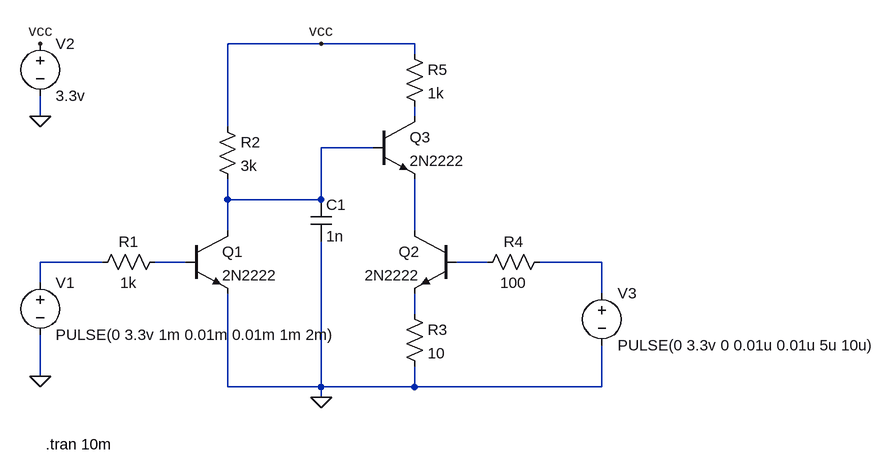
[diagram p0: schematic ook_transmitter.asc]
ook_transmitter.asc, the LTspice schematic file:
Version 4
SHEET 1 1280 680
WIRE 400 -240 256 -240
WIRE 544 -240 400 -240
WIRE 544 -224 544 -240
WIRE -32 -128 -32 -160
WIRE 544 -128 544 -144
WIRE 256 -112 256 -240
WIRE 480 -80 400 -80
WIRE 256 0 256 -32
WIRE 400 0 400 -80
WIRE 400 0 256 0
WIRE 256 48 256 0
WIRE 544 48 544 -32
WIRE 64 96 -32 96
WIRE 192 96 144 96
WIRE 656 96 608 96
WIRE 832 96 736 96
WIRE -32 128 -32 96
WIRE 832 144 832 96
WIRE 544 176 544 144
WIRE -32 272 -32 208
WIRE 256 288 256 144
WIRE 400 288 400 64
WIRE 400 288 256 288
WIRE 544 288 544 256
WIRE 544 288 400 288
WIRE 832 288 832 224
WIRE 832 288 544 288
WIRE 400 304 400 288
FLAG 400 304 0
FLAG -32 272 0
FLAG -32 -128 0
FLAG -32 -240 vcc
FLAG 400 -240 vcc
SYMBOL voltage -32 112 R0
WINDOW 123 0 0 Left 0
WINDOW 39 0 0 Left 0
SYMATTR InstName V1
SYMATTR Value PULSE(0 3.3v 1m 0.01m 0.01m 1m 2m)
SYMBOL res 160 80 R90
WINDOW 0 0 56 VBottom 2
WINDOW 3 32 56 VTop 2
SYMATTR InstName R1
SYMATTR Value 1k
SYMBOL npn 192 48 R0
SYMATTR InstName Q1
SYMATTR Value 2N2222
SYMBOL npn 608 48 M0
SYMATTR InstName Q2
SYMATTR Value 2N2222
SYMBOL npn 480 -128 R0
SYMATTR InstName Q3
SYMATTR Value 2N2222
SYMBOL res 240 -128 R0
SYMATTR InstName R2
SYMATTR Value 3k
SYMBOL res 528 160 R0
SYMATTR InstName R3
SYMATTR Value 10
SYMBOL cap 384 0 R0
SYMATTR InstName C1
SYMATTR Value 1n
SYMBOL res 752 80 R90
WINDOW 0 0 56 VBottom 2
WINDOW 3 32 56 VTop 2
SYMATTR InstName R4
SYMATTR Value 100
SYMBOL voltage -32 -256 R0
WINDOW 123 0 0 Left 0
WINDOW 39 0 0 Left 0
SYMATTR InstName V2
SYMATTR Value 3.3v
SYMBOL voltage 832 128 R0
WINDOW 123 0 0 Left 0
WINDOW 39 0 0 Left 0
SYMATTR InstName V3
SYMATTR Value PULSE(0 3.3v 0 0.01u 0.01u 5u 10u)
SYMBOL res 528 -240 R0
SYMATTR InstName R5
SYMATTR Value 1k
TEXT -24 376 Left 2 !.tran 10m

The netlist it stands for:
* ook_transmitter.asc
V1 N004 0 PULSE(0 3.3v 1m 0.01m 0.01m 1m 2m)
R1 N005 N004 1k
Q1 N002 N005 0 0 2N2222
Q2 N003 N006 N008 0 2N2222
Q3 N001 N002 N003 0 2N2222
R2 vcc N002 3k
R3 N008 0 10
C1 N002 0 1n
R4 N007 N006 100
V2 vcc 0 3.3v
V3 N007 0 PULSE(0 3.3v 0 0.01u 0.01u 5u 10u)
R5 vcc N001 1k
.model NPN NPN
.model PNP PNP
.lib standard.bjt
.tran 10m
.backanno
.end